# Altium schematic sheet ESP8266.SchDoc
size A4
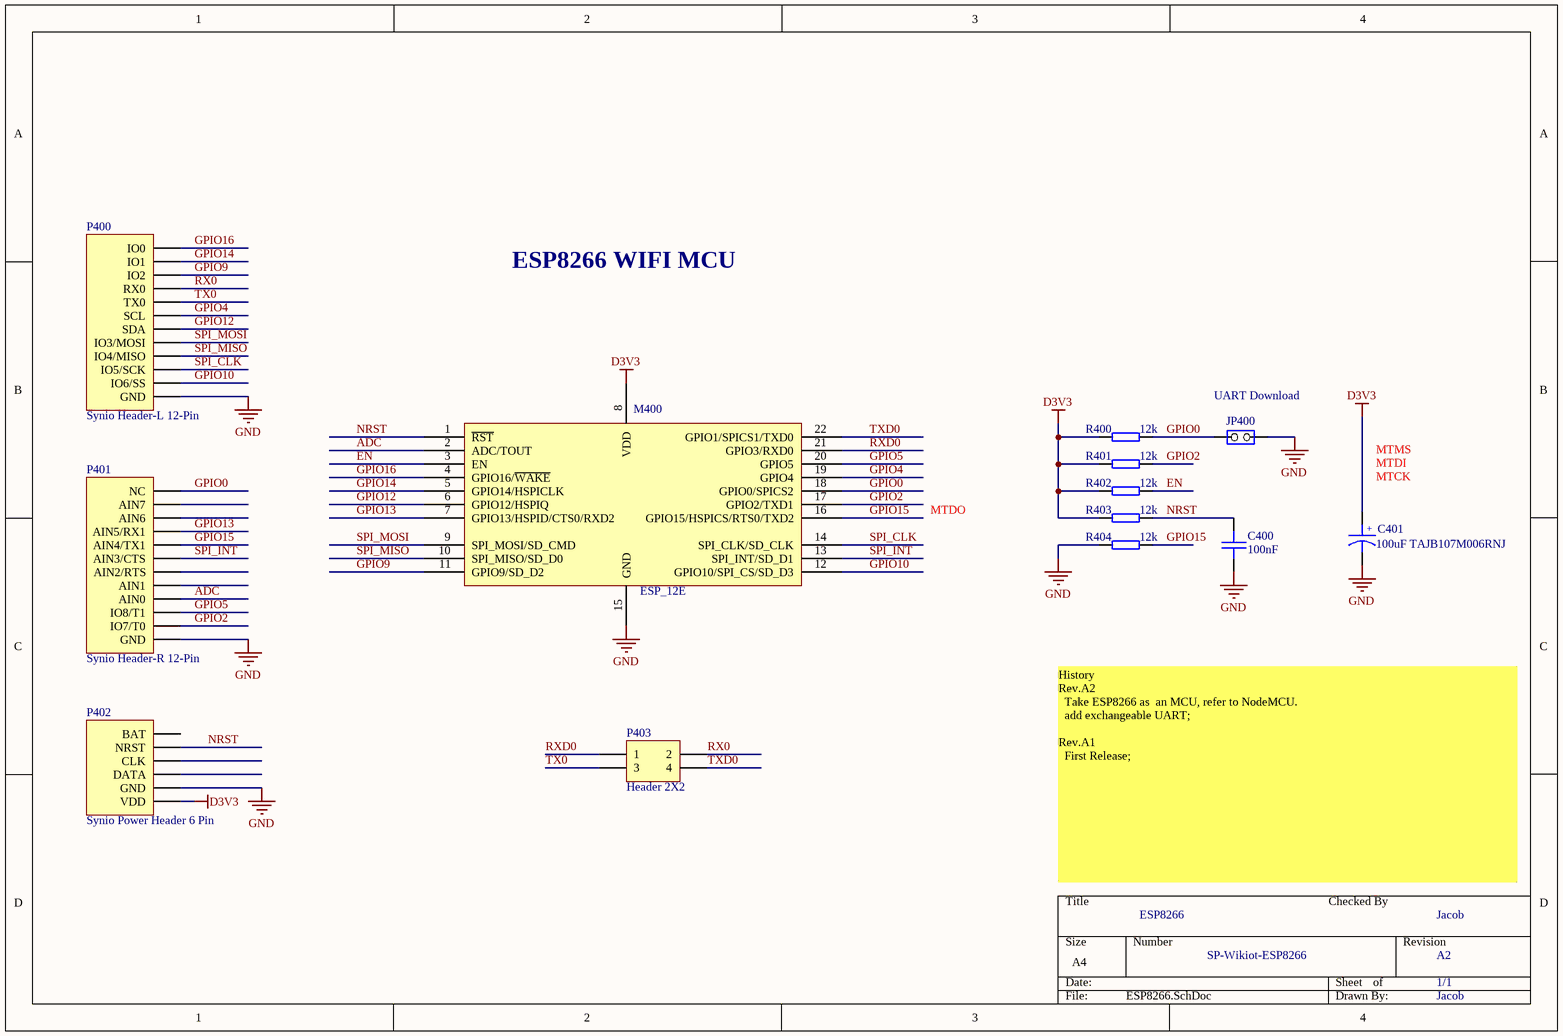
[diagram p0: ESP8266.SchDoc]

## Parts
C400  100nF  [C0603L]
C401  100uF TAJB107M006RNJ  [SMT_C_Tantalum_B]
JP400  UART Download  [SIP2]
M400  ESP_12E  [ESP_12E]
P400  Synio Header-L 12-Pin  [HDR1X12/2.54MM]
P401  Synio Header-R 12-Pin  [HDR1X12/2.54MM]
P402  Synio Power Header 6 Pin  [HDR1X6/2.54MM]
P403  Header 2X2  [JUMPER4_SMD]
R400  12k  [R0603]
R401  12k  [R0603]
R402  12k  [R0603]
R403  12k  [R0603]
R404  12k  [R0603]

## Nets
D3V3: C401.1 M400.8(VDD) P402.1(VDD) R400.1 R401.1 R402.1 R403.1
GND: C400.2 C401.2 JP400.1(COMMON) M400.15(GND) P400.1(GND) P401.1(GND) P402.2(GND) R404.1
ADC: M400.2(ADC/TOUT) P401.4(AIN0)
EN: M400.3(EN) R402.2
GPIO0: JP400.2(NO) M400.18(GPIO0/SPICS2) P401.12(NC) R400.2
GPIO2: M400.17(GPIO2/TXD1) P401.2(IO7/T0) R401.2
GPIO4: M400.19(GPIO4) P400.7(SCL)
GPIO5: M400.20(GPIO5) P401.3(IO8/T1)
GPIO9: M400.11(GPIO9/SD_D2) P400.10(IO2)
GPIO10: M400.12(GPIO10/SPI_CS/SD_D3) P400.2(IO6/SS)
GPIO12: M400.6(GPIO12/HSPIQ) P400.6(SDA)
GPIO13: M400.7(GPIO13/HSPID/CTS0/RXD2) P401.9(AIN5/RX1)
GPIO14: M400.5(GPIO14/HSPICLK) P400.11(IO1)
GPIO15: M400.16(GPIO15/HSPICS/RTS0/TXD2) P401.8(AIN4/TX1) R404.2
GPIO16: M400.4(GPIO16/~{WAKE}) P400.12(IO0)
NRST: C400.1 M400.1(~{RST}) P402.5(NRST) R403.2
RX0: P400.9(RX0) P403.2
RXD0: M400.21(GPIO3/RXD0) P403.1
SPI_CLK: M400.14(SPI_CLK/SD_CLK) P400.3(IO5/SCK)
SPI_INT: M400.13(SPI_INT/SD_D1) P401.7(AIN3/CTS)
SPI_MISO: M400.10(SPI_MISO/SD_D0) P400.4(IO4/MISO)
SPI_MOSI: M400.9(SPI_MOSI/SD_CMD) P400.5(IO3/MOSI)
TX0: P400.8(TX0) P403.3
TXD0: M400.22(GPIO1/SPICS1/TXD0) P403.4

Not connected (* = marked no-connect by the designer): P401 5(AIN1) 6(AIN2/RTS) 10(AIN6) 11(AIN7); P402 3(DATA) 4(CLK) 6(BAT)

## Notes on the sheet
- ESP8266 WIFI MCU
- MTDO
- (near C401) MTCK
- MTDI
- MTMS
- History
  Rev.A2
  Take ESP8266 as  an MCU, refer to NodeMCU.
  add exchangeable UART;
  Rev.A1
  First Release;
- ESP8266
- Checked By
- Jacob
- SP-Wikiot-ESP8266
- A2
- 1/1
- (in symbol SMT_C_Tantalum_B) +

## Library data of the parts
C400 = SMT_C_0402: Surface mount capacitor 0402
C401 = SMT_C_Tantalum_B: Capacitor, SM Tantalum; Body 3.5 x 2.8 mm (LxW typ)
JP400 = Jumper2-2: Jumper2
M400 = ESP_12E: ESP-12 Wi-Fi Module by AI-Thinker; IC: ESP8266-EX; Vendor: Ai-thinker
P400 = Synio Header-L 12-Pin: Synio Header-L, 12-Pin; LatestRevisionDate: 17-Jul-2002; LatestRevisionNote: Re-released for DXP Platform.; Publisher: Altium Limited
P401 = Synio Header-R 12-Pin: Synio Header-R, 12-Pin; LatestRevisionDate: 17-Jul-2002; LatestRevisionNote: Re-released for DXP Platform.; Publisher: Altium Limited
P403 = Header 2X2: Header, 2-Pin, Dual row; LatestRevisionDate: 17-Jul-2002; LatestRevisionNote: Re-released for DXP Platform.; Publisher: Altium Limited
R400-R404 = SMT_R_0402: Surface mount resistor 0402